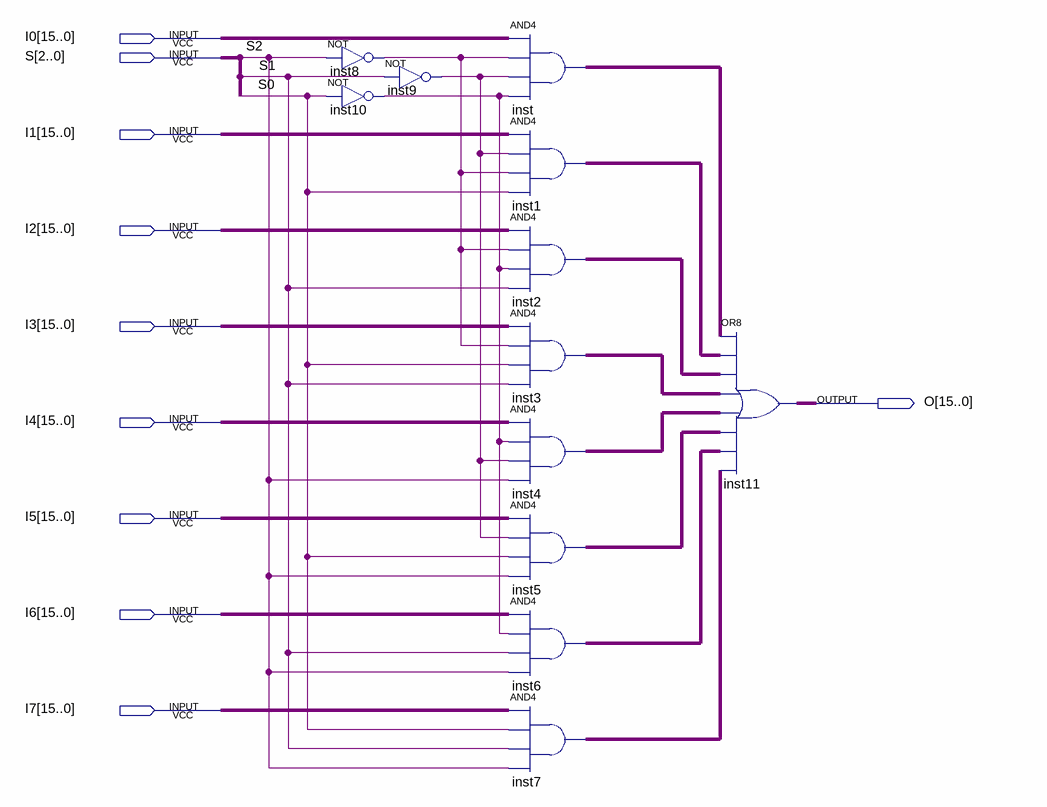
[diagram p0: schematic sheet]
// Quartus schematic Mux38_16bit.bdf as structural Verilog: 12 symbols, 10 pins
module Mux38_16bit (
  input  [15:0] I0,
  input  [2:0] S,
  input  [15:0] I1,
  input  [15:0] I2,
  input  [15:0] I3,
  input  [15:0] I4,
  input  [15:0] I5,
  input  [15:0] I6,
  input  [15:0] I7,
  output [15:0] O
);

  wire inst8_out, inst9_out, inst10_out;
  wire [15:0] inst1_out, inst2_out, inst3_out, inst4_out, inst5_out, inst6_out, inst7_out, inst_out;

  not inst8 (inst8_out, S[2]);
  not inst10 (inst10_out, S[0]);
  not inst9 (inst9_out, S[1]);
  assign inst_out = I0 & {16{inst8_out}} & {16{inst9_out}} & {16{inst10_out}};  // AND4 inst, 16 bits wide
  assign inst1_out = I1 & {16{inst9_out}} & {16{inst8_out}} & {16{S[0]}};  // AND4 inst1, 16 bits wide
  assign inst2_out = I2 & {16{inst8_out}} & {16{inst10_out}} & {16{S[1]}};  // AND4 inst2, 16 bits wide
  assign inst3_out = I3 & {16{inst8_out}} & {16{S[0]}} & {16{S[1]}};  // AND4 inst3, 16 bits wide
  assign inst4_out = I4 & {16{inst10_out}} & {16{inst9_out}} & {16{S[2]}};  // AND4 inst4, 16 bits wide
  assign inst5_out = I5 & {16{inst9_out}} & {16{S[0]}} & {16{S[2]}};  // AND4 inst5, 16 bits wide
  assign inst6_out = I6 & {16{inst10_out}} & {16{S[1]}} & {16{S[2]}};  // AND4 inst6, 16 bits wide
  assign inst7_out = I7 & {16{S[0]}} & {16{S[1]}} & {16{S[2]}};  // AND4 inst7, 16 bits wide
  assign O = inst_out | inst1_out | inst2_out | inst3_out | inst4_out | inst5_out | inst6_out | inst7_out;  // OR8 inst11, 16 bits wide
endmodule
